# EasyEDA schematic outDoorSche.json

## Sheets
1 Out_door: TITLE: Sheet_1; REV: 1.0; Date: 2020-06-14; Sheet: 1/1; Drawn By: quanghuy6999; Company: Your Company
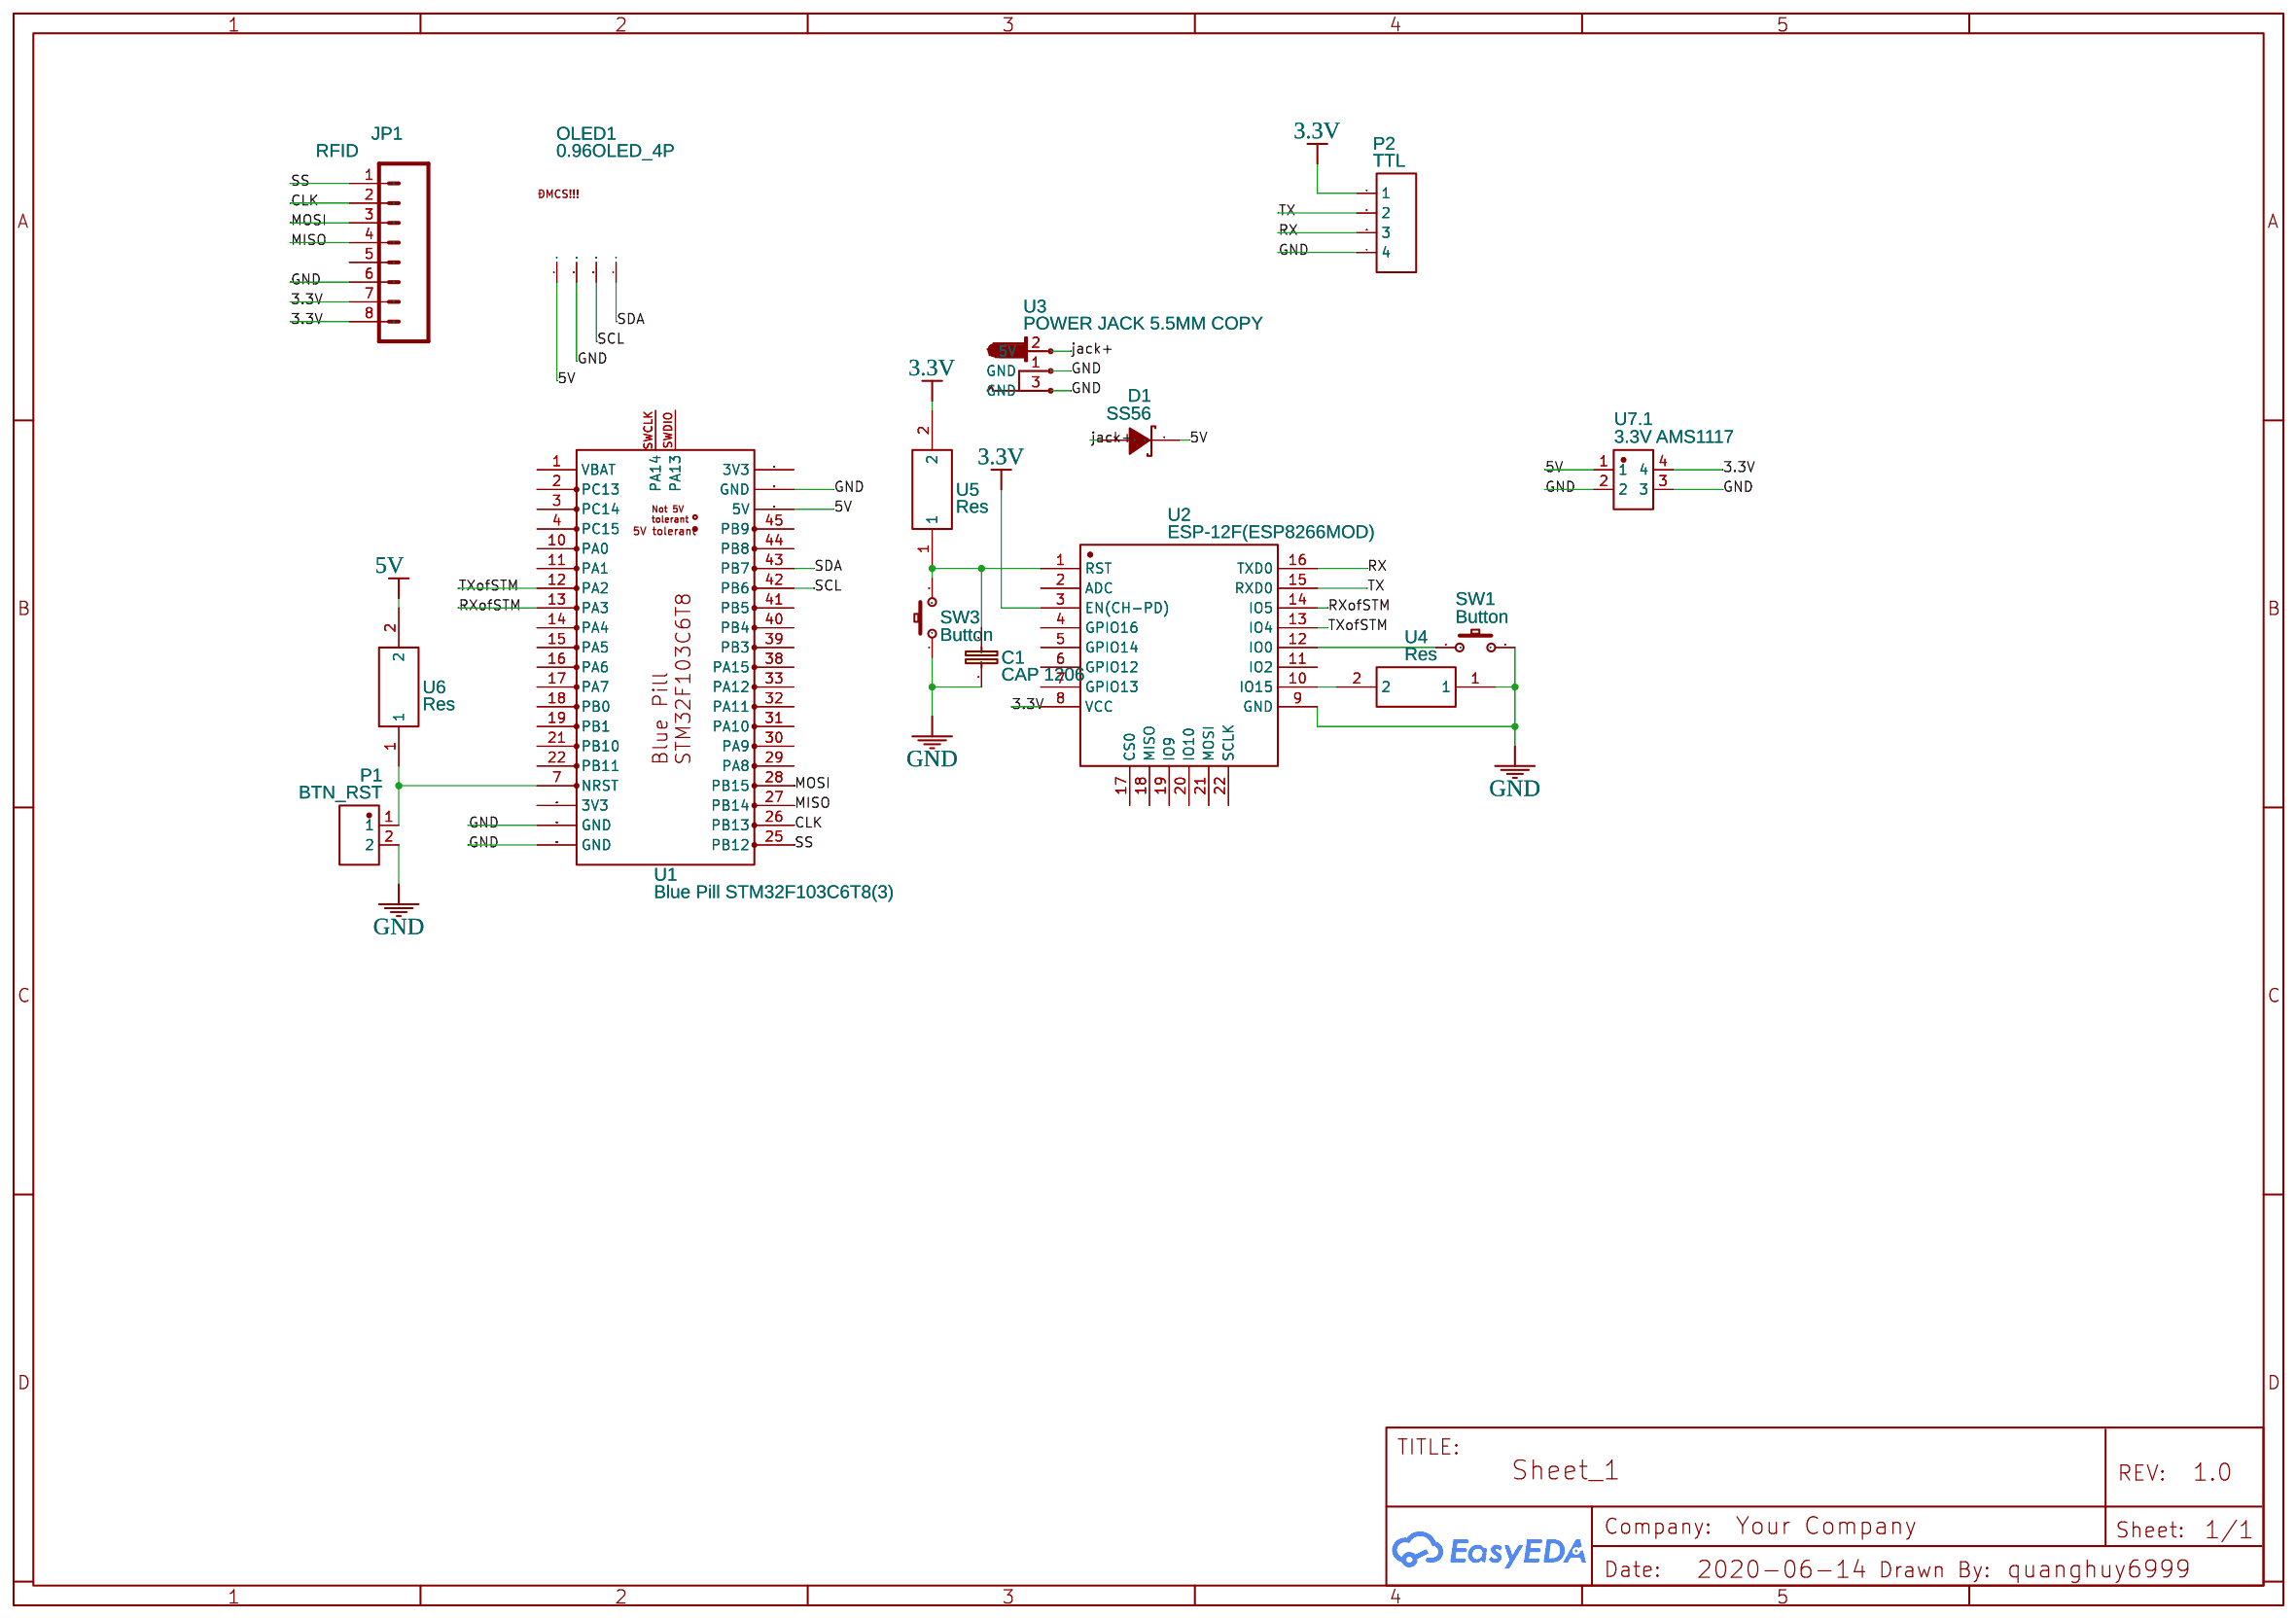
[diagram p0: Out_door]
2 In_door: TITLE: Sheet_2; Date: 2020-06-19
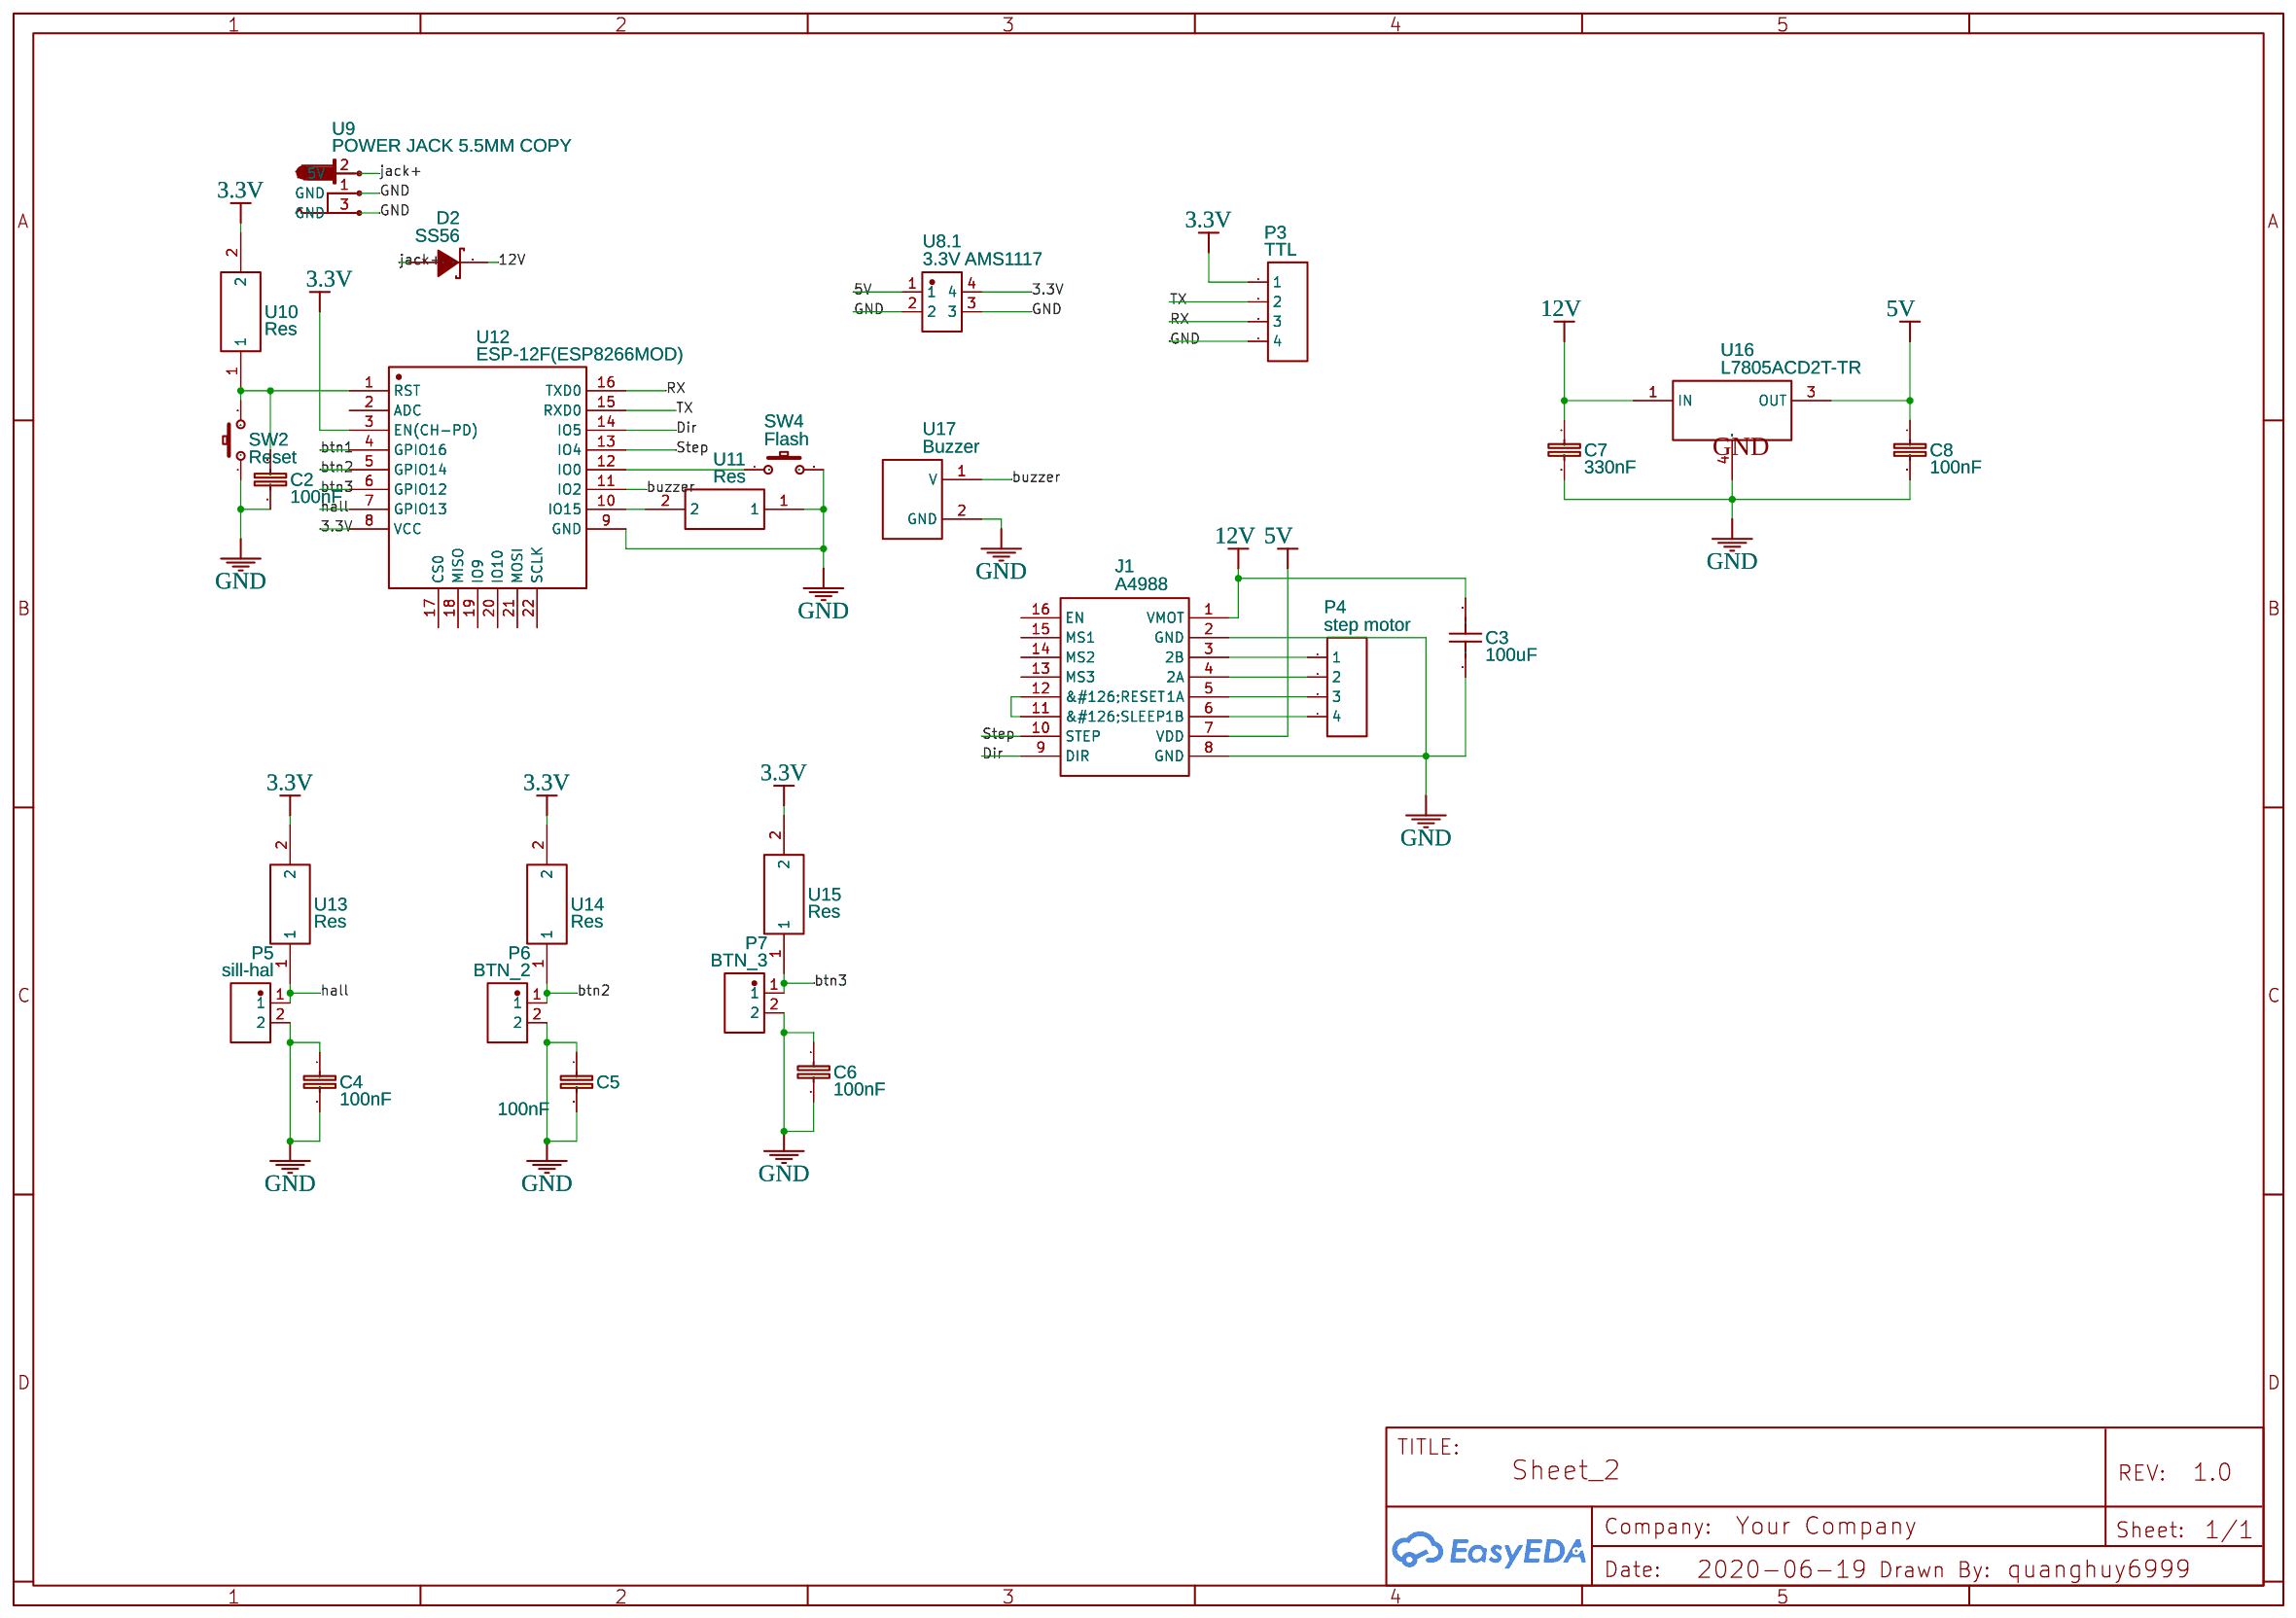
[diagram p1: In_door]

## Parts
sheet In_door
C2  100nF  [CAP 1206]
C3  100uF  [RAD-0.1]
C4  100nF  [CAP 1206]
C5  100nF  [CAP 1206]
C6  100nF  [CAP 1206]
C7  330nF  [CAP 1206]
C8  100nF  [CAP 1206]
D2  SS56  [SMA_L4.3-W2.6-LS5.2-RD]
J1  A4988  [A4988]
P3  TTL  [HDR-4X1/2.54]
P4  step motor  [HDR-4X1/2.54]
P5  sill-hal  [HDR-TH_2P-P2.00-V]
P6  BTN_2  [HDR-TH_2P-P2.00-V]
P7  BTN_3  [HDR-TH_2P-P2.00-V]
SW2  Reset  [K2-1107ST-A4SW-06]
SW4  Flash  [K2-1107ST-A4SW-06]
U8  3.3V AMS1117  [3.3V AMS1117]  (section 1)
U9  POWER JACK 5.5MM COPY  [DC_POWER_JACK]
U10  Res  [0805R]
U11  Res  [0805R]
U12  ESP-12F(ESP8266MOD)  [WIFIM-SMD_ESP-12F-ESP8266MOD]
U13  Res  [0805R]
U14  Res  [0805R]
U15  Res  [0805R]
U16  L7805ACD2T-TR  [TO-263-2_L10.0-W9.1-P5.08-LS15.2-TL]
U17  Buzzer  [BUZZER]
sheet Out_door
C1  CAP 1206  [CAP 1206]
D1  SS56  [SMA_L4.3-W2.6-LS5.2-RD]
JP1  RFID  [1X08_PIN1_NO_SILK]
OLED1  0.96OLED_4P  [0.96OLED_4P]
P1  BTN_RST  [HDR-TH_2P-P2.00-V]
P2  TTL  [HDR-4X1/2.54]
SW1  Button  [K2-1107ST-A4SW-06]
SW3  Button  [K2-1107ST-A4SW-06]
U1  Blue Pill STM32F103C6T8(3)  [BLUE PILL STM32F103C6T8(2)]
U2  ESP-12F(ESP8266MOD)  [WIFIM-SMD_ESP-12F-ESP8266MOD]
U3  POWER JACK 5.5MM COPY  [DC_POWER_JACK]
U4  Res  [0805R]
U5  Res  [0805R]
U6  Res  [0805R]
U7  3.3V AMS1117  [3.3V AMS1117]  (section 1)

## Library data of the parts
C1 C2 C4-C8 = CAP 1206: Capacitor; Contributor: tuncel3
C3 = Cap_RAD-0.1_US
D1 D2 = SS56: Supplier: LCSC; Manufacturer: MDD; image: //image.lceda.cn/szlcsc/C65009.jpg; Supplier Part: C65009; LCSC Assembly: Yes; SMT Type: Extend
J1 = A4988: Supplier Part: C49256; Supplier: DRIVER; Manufacturer: ReliaPro; Manufacturer Part: Header2.54mm 1*8P; image: http://image.lceda.cn/szlcsc/C49256.jpg; Contributor: Huy Quang
P2-P4 = Header-Female-2.54_1x4: Supplier: LCSC; Manufacturer: ReliaPro; Supplier Part: C124413
P1 P5-P7 = Female header1*2P: Supplier: LCSC; Manufacturer: BOOMELE; Supplier Part: C66509
SW1-SW4 = Button: Supplier: LCSC; Supplier Part: C118141; Manufacturer: Rectangular Connectors - Contacts; Contributor: jousterde1
U7 U8 = 3.3V AMS1117: Contributor: quanghuy6999; subpart_no: 1
U3 U9 = POWER JACK 5.5MM COPY: Manufacturer Part: Power jack 5.5mm; Contributor: moddosan
U4-U6 U10 U11 U13-U15 = Res: Contributor: eggheadjoseph
U2 U12 = ESP-12F(ESP8266MOD): Supplier: LCSC; Manufacturer: Ai-Thinker; Supplier Part: C82891
U16 = L7805ACD2T-TR: Supplier: LCSC; Manufacturer: STMicroelectronics; image: //image.lceda.cn/szlcsc/C53236.jpg; Supplier Part: C53236; LCSC Assembly: Yes; SMT Type: Extend
U17 = Buzzer: Supplier: DRIVER; Contributor: quanghuy6999
JP1 = HEADER8: Contributor: SparkFun; sourceId: cbHBvNHZS
OLED1 = 0.96OLED_4P: Supplier: LCSC; Contributor: LCEDA_Lib
U1 = Blue Pill STM32F103C6T8(3): Contributor: romkli

## Nets
3.3V: JP1.7 JP1.8 P2.1 P3.1 U2.3(EN(CH-PD)) U2.8(VCC) U5.2 U7.4 U8.4 U10.2 U12.3(EN(CH-PD)) U12.8(VCC) U13.2 U14.2 U15.2
5V: C8.1 D1.1(K) J1.7(VDD) OLED1.1 U1.5V U6.2 U7.1 U8.1 U16.3(OUT)
12V: C3.2 C7.1 D2.1(K) J1.1(VMOT) U16.1(IN)
GND: C1.2 C2.2 C3.1 C4.1 C4.2 C5.1 C5.2 C6.1 C6.2 C7.2 C8.2 J1.2(GND) J1.8(GND) JP1.6 OLED1.2 P1.2 P2.4 P3.4 P5.2 P6.2 P7.2 SW1.2 SW2.1 SW3.1 SW4.2 U1.GND U2.9(GND) U3.1(GND) U3.3(GND) U4.1 U7.2 U7.3 U8.2 U8.3 U9.1(GND) U9.3(GND) U11.1 U12.9(GND) U16.4(GND) U17.2(GND)
btn1: U12.4(GPIO16)
btn2: P6.1 U12.5(GPIO14) U14.1
btn3: P7.1 U12.6(GPIO12) U15.1
buzzer: U12.11(IO2) U17.1(V)
CLK: JP1.2 U1.26(PB13)
Dir: J1.9(DIR) U12.14(IO5)
hall: P5.1 U12.7(GPIO13) U13.1
jack+: D1.2(A) D2.2(A) U3.2(5V) U9.2(5V)
MISO: JP1.4 U1.27(PB14)
MOSI: JP1.3 U1.28(PB15)
RX: P2.3 P3.3 U2.16(TXD0) U12.16(TXD0)
RXofSTM: U1.13(PA3) U2.14(IO5)
SCL: OLED1.3 U1.42(PB6)
SDA: OLED1.4 U1.43(PB7)
SS: JP1.1 U1.25(PB12)
Step: J1.10(STEP) U12.13(IO4)
TX: P2.2 P3.2 U2.15(RXD0) U12.15(RXD0)
TXofSTM: U1.12(PA2) U2.13(IO4)
Net-(C1-1): C1.1 SW3.2 U2.1(RST) U5.1
Net-(C2-1): C2.1 SW2.2 U10.1 U12.1(RST)
Net-(J1-3): J1.3(2B) P4.1
Net-(J1-4): J1.4(2A) P4.2
Net-(J1-5): J1.5(1A) P4.3
Net-(J1-6): J1.6(1B) P4.4
Net-(J1-11): J1.11(&#126;SLEEP) J1.12(&#126;RESET)
Net-(P1-1): P1.1 U1.7(NRST) U6.1
Net-(SW1-1): SW1.1 U2.12(IO0)
Net-(SW4-1): SW4.1 U12.12(IO0)
Net-(U2-10): U2.10(IO15) U4.2
Net-(U11-2): U11.2 U12.10(IO15)

Not connected (* = marked no-connect by the designer): J1 13(MS3) 14(MS2) 15(MS1) 16(EN); JP1 5; U1 1(VBAT) 2(PC13) 3(PC14) 3V3 4(PC15) 10(PA0) 11(PA1) 14(PA4) 15(PA5) 16(PA6) 17(PA7) 18(PB0) 19(PB1) 21(PB10) 22(PB11) 29(PA8) 30(PA9) 31(PA10) 32(PA11) 33(PA12) 38(PA15) 39(PB3) 40(PB4) 41(PB5) 44(PB8) 45(PB9) SWCLK(PA14) SWDIO(PA13); U2 2(ADC) 4(GPIO16) 5(GPIO14) 6(GPIO12) 7(GPIO13) 11(IO2) 17(CS0) 18(MISO) 19(IO9) 20(IO10) 21(MOSI) 22(SCLK); U12 2(ADC) 17(CS0) 18(MISO) 19(IO9) 20(IO10) 21(MOSI) 22(SCLK)
